# Altium schematic sheet TFT_MicroSD.SchDoc: TFT_MicroSD
size A3; Project: STM32L073Z-EVAL; Date: Not used; ApprovedBy: Not used; CheckedBy: Not used; Author: Not used; CompanyName: STMicroelectronics; DrawnBy: Not used; Engineer: Not used; Organization: Not used; Address1: Not used; Address2: Not used; Address3: Not used; Address4: Not used; DocumentNumber: 6; Revision: Not used; SheetNumber: 7; SheetTotal: 13; CurrentTime: Not used; CurrentDate: Not used; Time: Not used; DocumentFullPathAndName: Not used; DocumentName: Not used; ModifiedDate: Not used; ImagePath: Not used; ProjectName: Not used; Application_BuildNumber: Not used
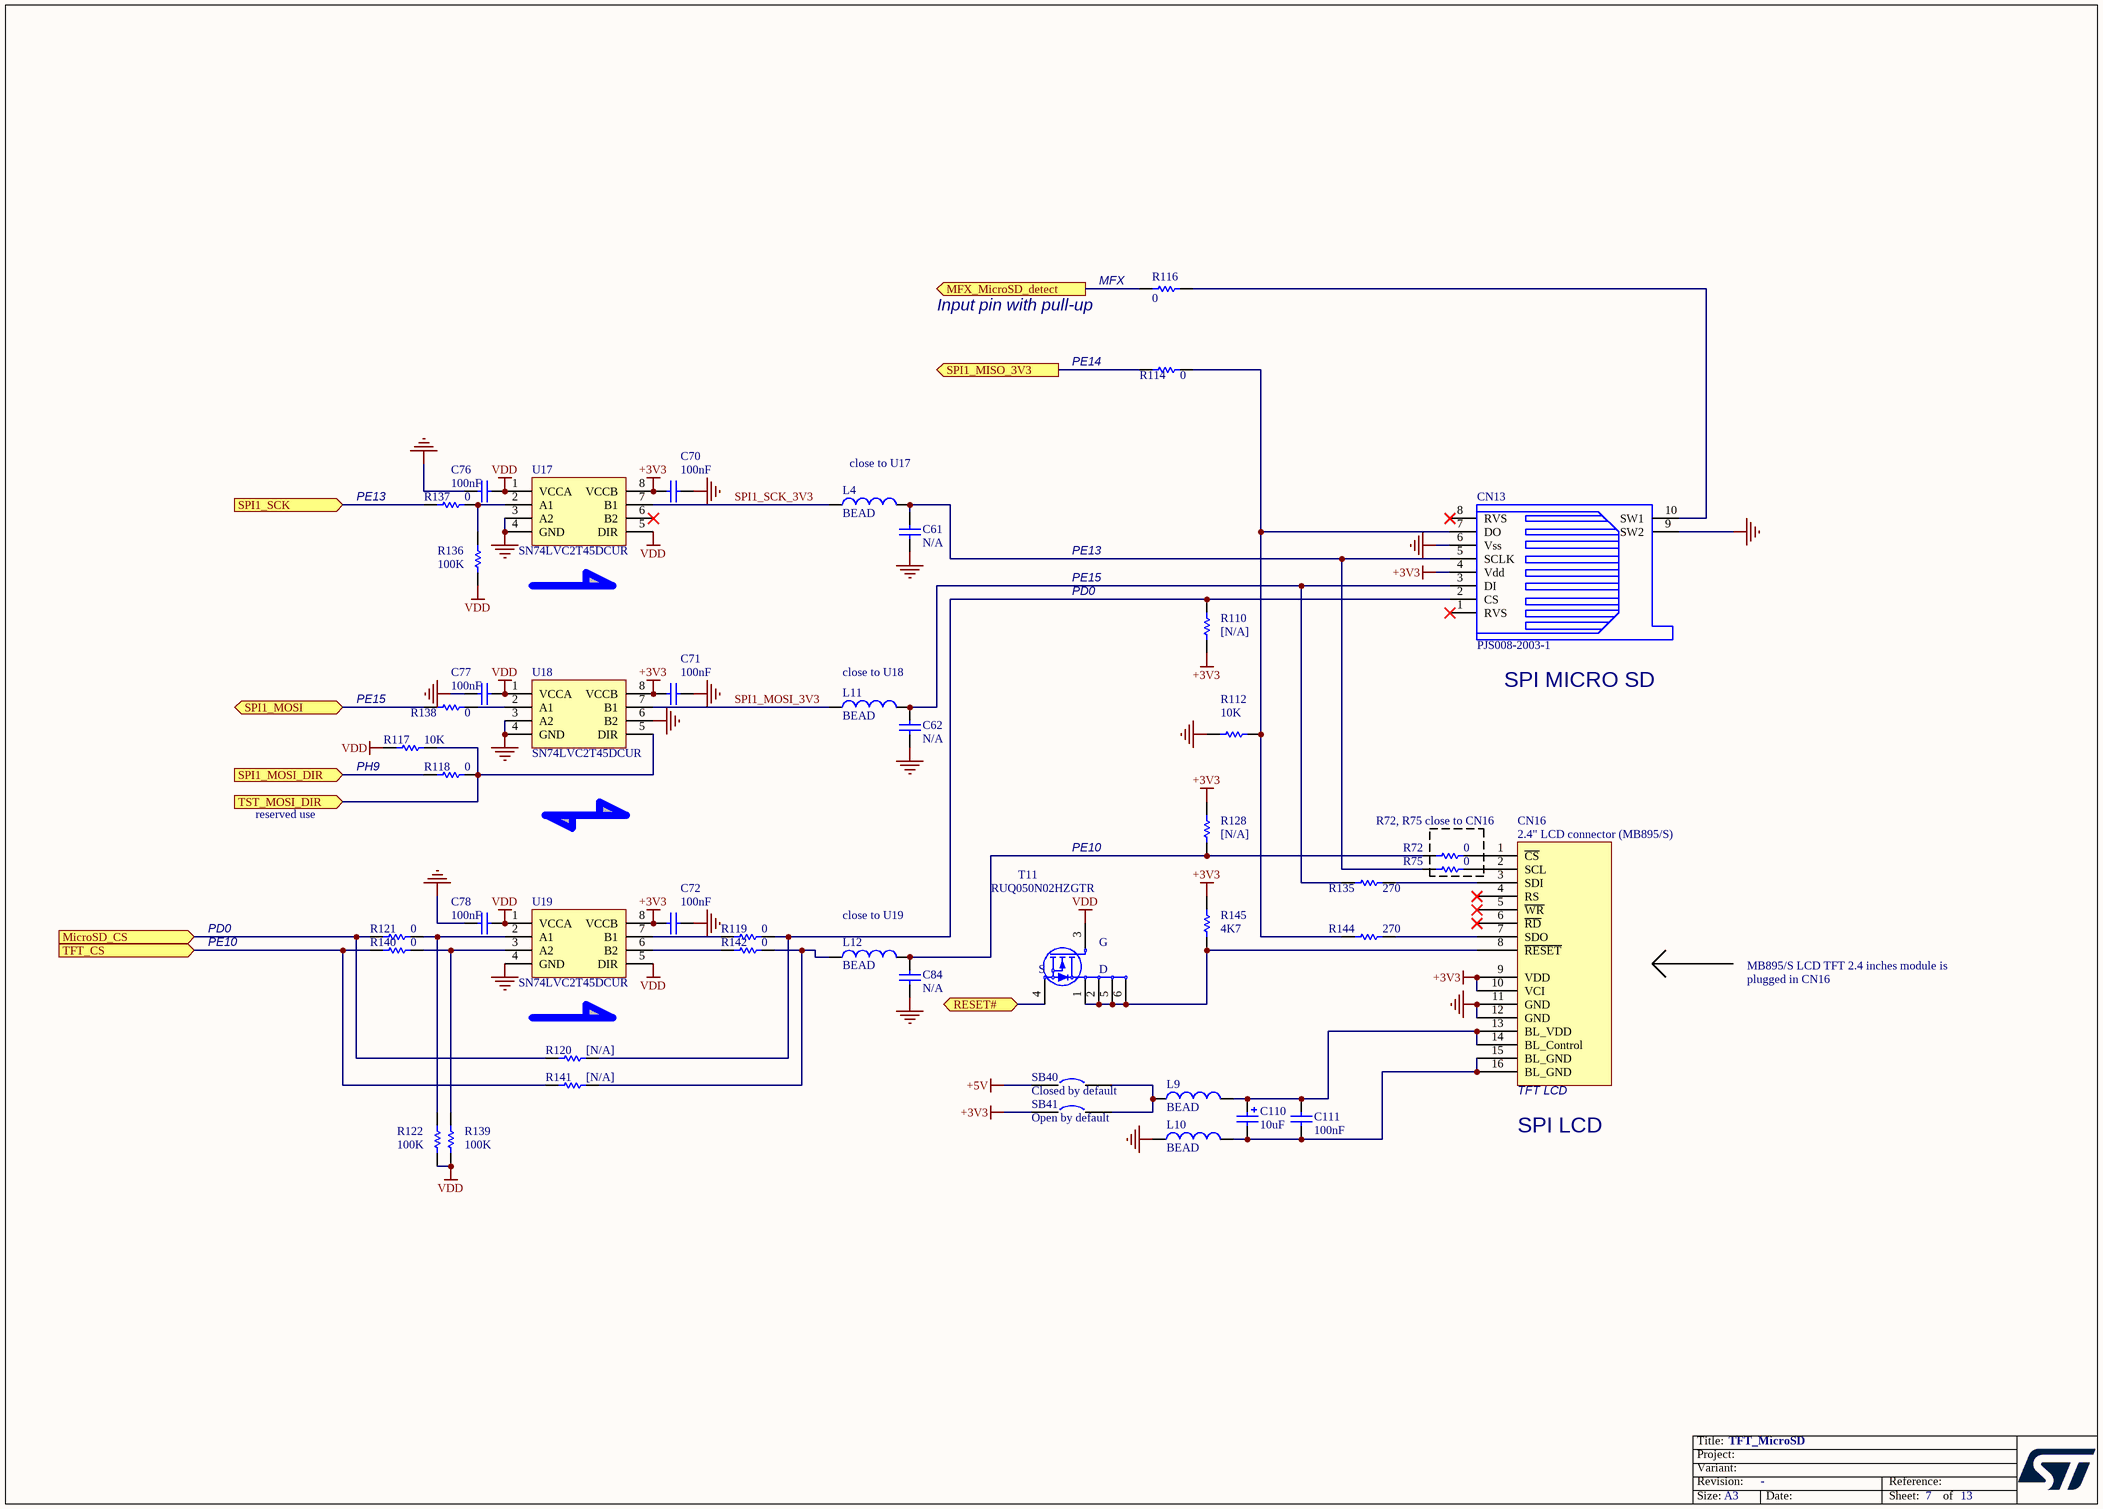
[diagram p0: TFT_MicroSD.SchDoc]

## Parts
C61  N/A  [0603C]
C62  N/A  [0603C]
C70  100nF  [0402C]
C71  100nF  [0402C]
C72  100nF  [0402C]
C76  100nF  [0402C]
C77  100nF  [0402C]
C78  100nF  [0402C]
C84  N/A  [0603C]
C110  10uF  [TAN-A]
C111  100nF  [0402C]
CN13  PJS008-2003-1  [MSD_PJS008_]
CN16  2.4" LCD connector (MB895/S)  [MB895CS]
L4  BEAD  [0603L]
L9  BEAD  [0603L]
L10  BEAD  [0603L]
L11  BEAD  [0603L]
L12  BEAD  [0603L]
R72  0  [0603R]
R75  0  [0603R]
R110  [N/A]  [0603R]
R112  10K  [0402R]
R114  0  [0603R]
R116  0  [0603R]
R117  10K  [0402R]
R118  0  [0603R]
R119  0  [0603R]
R120  [N/A]  [0603R]
R121  0  [0603R]
R122  100K  [0603R]
R128  [N/A]  [0603R]
R135  270  [0603R]
R136  100K  [0603R]
R137  0  [0603R]
R138  0  [0603R]
R139  100K  [0603R]
R140  0  [0603R]
R141  [N/A]  [0603R]
R142  0  [0603R]
R144  270  [0603R]
R145  4K7  [0402R]
SB40  Closed by default  [SB_0603]
SB41  Open by default  [SB_0603]
T11  RUQ050N02HZGTR  [SOT23-6L]
U17  SN74LVC2T45DCUR  [USOP8_0R5_2X3R1]
U18  SN74LVC2T45DCUR  [USOP8_0R5_2X3R1]
U19  SN74LVC2T45DCUR  [USOP8_0R5_2X3R1]

## Ports
MFX_MicroSD_detect (out), MicroSD_CS (in), RESET# (bidir), SPI1_MISO_3V3 (out), SPI1_MOSI (bidir), SPI1_MOSI_DIR (in), SPI1_SCK (in), TFT_CS (in), TST_MOSI_DIR (in)

## Nets
+3V3: C70.2 C71.2 C72.2 CN13.4(Vdd) CN16.9(VDD) CN16.10(VCI) R110.2 R128.2 R145.2 SB41.1 U17.8(VCCB) U18.8(VCCB) U19.8(VCCB)
+5V: SB40.1
GND: C61.1 C62.1 C70.1 C71.1 C72.1 C76.1 C77.1 C78.1 C84.1 CN13.6(Vss) CN13.9(SW2) CN16.11(GND) CN16.12(GND) L10.1 R112.1 U17.3(A2) U17.4(GND) U18.3(A2) U18.4(GND) U18.6(B2) U19.4(GND)
VDD: C76.2 C77.2 C78.2 R117.2 R122.2 R136.2 R139.2 T11.3(G) U17.1(VCCA) U17.5(DIR) U18.1(VCCA) U19.1(VCCA) U19.5(DIR)
MFX_MicroSD_detect: R116.1 ; port MFX_MicroSD_detect
MicroSD_CS: R120.1 R121.2 ; port MicroSD_CS
RESET#: T11.4(S) ; port RESET#
SPI1_MISO_3V3: R114.2 ; port SPI1_MISO_3V3
SPI1_MOSI: R138.2 ; port SPI1_MOSI
SPI1_MOSI_3V3: L11.1 U18.7(B1)
SPI1_MOSI_DIR: R118.2 ; port SPI1_MOSI_DIR
SPI1_SCK: R137.2 ; port SPI1_SCK
SPI1_SCK_3V3: L4.1 U17.7(B1)
TFT_CS: R140.1 R141.1 ; port TFT_CS
TST_MOSI_DIR: R117.1 R118.1 U18.5(DIR) ; port TST_MOSI_DIR
NetC61_2: C61.2 CN13.5(SCLK) L4.2 R75.1
NetC62_2: C62.2 CN13.3(DI) L11.2 R135.2
NetC84_2: C84.2 L12.2 R72.1 R128.1
NetC110_1: C110.1 C111.1 CN16.13(BL_VDD) CN16.14(BL_Control) L9.2
NetC110_2: C110.2 C111.2 CN16.15(BL_GND) CN16.16(BL_GND) L10.2
NetCN13_2: CN13.2(CS) R110.1 R119.1 R120.2
NetCN13_7: CN13.7(DO) R112.2 R114.1 R144.1
NetCN13_10: CN13.10(SW1) R116.2
NetCN16_1: CN16.1(~{CS}) R72.2
NetCN16_2: CN16.2(SCL) R75.2
NetCN16_3: CN16.3(SDI) R135.1
NetCN16_7: CN16.7(SDO) R144.2
NetCN16_8: CN16.8(~{RESET}) R145.1 T11.1(S) T11.2(S) T11.5(D) T11.6(D)
NetL9_1: L9.1 SB40.2 SB41.2
NetL12_1: L12.1 R141.2 R142.1
NetR119_2: R119.2 U19.7(B1)
NetR121_1: R121.1 R122.1 U19.2(A1)
NetR136_1: R136.1 R137.1 U17.2(A1)
NetR138_1: R138.1 U18.2(A1)
NetR139_1: R139.1 R140.2 U19.3(A2)
NetR142_2: R142.2 U19.6(B2)

Not connected (* = marked no-connect by the designer): CN13 1(RVS)* 8(RVS)*; CN16 4(RS)* 5(~{WR})* 6(~{RD})*; U17 6(B2)*

## Notes on the sheet
- (near R116) Input pin with pull-up
- (near R116) MFX
- PE14
- PE13
- close to U17
- PE15
- PD0
- close to U18
- SPI MICRO SD
- (near R117) PH9
- reserved use
- PE10
- R72, R75 close to CN16
- close to U19
- MB895/S LCD TFT 2.4 inches module is plugged in CN16
- (near CN16) TFT LCD
- (near CN16) SPI LCD
- Title:
- Project:
- Size:
- Revision:
- Variant:
- A3
- -
- Date:
- Reference:
- Sheet:
- of

## Library data of the parts
C61 C62 C84 = CAP: Capacitor; Value: 100nF; Ordered by: Subcon; Fitted: NO; Published: 8-Jun-2000; Revision: July-2002: Re-released for DXP Platform.; Publisher: Altium Limited; ECCN_US/EU: n/a
C70-C72 C76-C78 = CAP: Capacitor; Value: 100pF; Ordered by: Subcon; Published: 8-Jun-2000; Revision: July-2002: Re-released for DXP Platform.; Publisher: Altium Limited; ECCN_US/EU: n/a
C110 = Cap Pol1: Polarized Capacitor (Radial); Ordered by: Subcon; Published: 8-Jun-2000; Revision: July-2002: Re-released for DXP Platform.; Publisher: Altium Limited; Value: 10uF; ECCN_US/EU: n/a
C111 = Cap: Capacitor; Value: 10nF; Ordered by: Subcon; Published: 8-Jun-2000; Revision: July-2002: Re-released for DXP Platform.; Publisher: Altium Limited; ECCN_US/EU: n/a
CN13 = SMS016AFA5E: Manuf_1: Yamaichi; Ordered by: Subcon; Silkscreen: uSD; Assembly: with uSD card; ECCN_US/EU: n/a; Manuf_Part_1: PJS008-2003-1
CN16 = ColorLCD_module: Manuf_1: lwconn; Manuf_Part_1: 216208S1311; Ordered by: Subcon; Assembly: with MB895/S; ECCN_US/EU: n/a
L4 L11 L12 = Inductor: Bead,600R,350mA,0603; Manuf_1: Wurth Elektronik; Manuf_Part_1: 742861160; Manuf_Part_2: 742863160; Value: 100uH; Ordered by: Subcon; Published: 8-Jun-2000; Revision: July-2002: Re-released for DXP Platform.; Publisher: Altium Limited; ECCN_US/EU: n/a; Manuf_2: Wurth Elektronik
L9 L10 = Inductor: Bead,600R,350mA,0603; Manuf_1: Tai-tech; Manuf_Part_1: FCM1608KF-601T05; Manuf_2: Wurth Elektronik; Manuf_Part_2: 742863160; Value: 100uH; Ordered by: Subcon; Published: 8-Jun-2000; Revision: July-2002: Re-released for DXP Platform.; Publisher: Altium Limited; ECCN_US/EU: n/a
R72 R75 R112 R114 R116-R118 R122 R135 R136 R139 R140 R144 R145 = Res1: Resistor; Value: 1K; Ordered by: Subcon; Published: 8-Jun-2000; Revision: July-2002: Re-released for DXP Platform.; Publisher: Altium Limited; ECCN_US/EU: n/a
R110 R120 R128 R141 = Res1: Resistor; Value: 1K; Ordered by: Subcon; Fitted: NO; Published: 8-Jun-2000; Revision: July-2002: Re-released for DXP Platform.; Publisher: Altium Limited; ECCN_US/EU: n/a
R119 R121 R137 R138 R142 = res1: Resistor; Value: 1K; Ordered by: Subcon; Published: 8-Jun-2000; Revision: July-2002: Re-released for DXP Platform.; Publisher: Altium Limited; ECCN_US/EU: n/a
SB40 = Circuit Breaker: Ordered by: Subcon; Comments: Solder bridge; Published: 24-Mar-1999; Revision: July-2002: Re-released for DXP Platform.; Publisher: Altium Limited; ECCN_US/EU: n/a
SB41 = Circuit Breaker: Ordered by: Subcon; Comments: Solder bridge; Fitted: NO; Published: 24-Mar-1999; Revision: July-2002: Re-released for DXP Platform.; Publisher: Altium Limited; ECCN_US/EU: n/a
T11 = STT5N2VH5: STripFETV Power MOSFET, N-CHANNEL 20V - 0.025 - 5A - SOT23-6L; Manuf_1: ST; Ref St: 9153047; ECCN_US/EU: EAR99/NEC; Manuf_Part_1: STT5N2VH5; Order: STT5N2VH5; Provided: ST; Distrib: ST; Ordered by: ST
U17-U19 = SN74LVC2T45DCUT: Ordered by: Subcon; ECCN_US/EU: EAR99/NEC